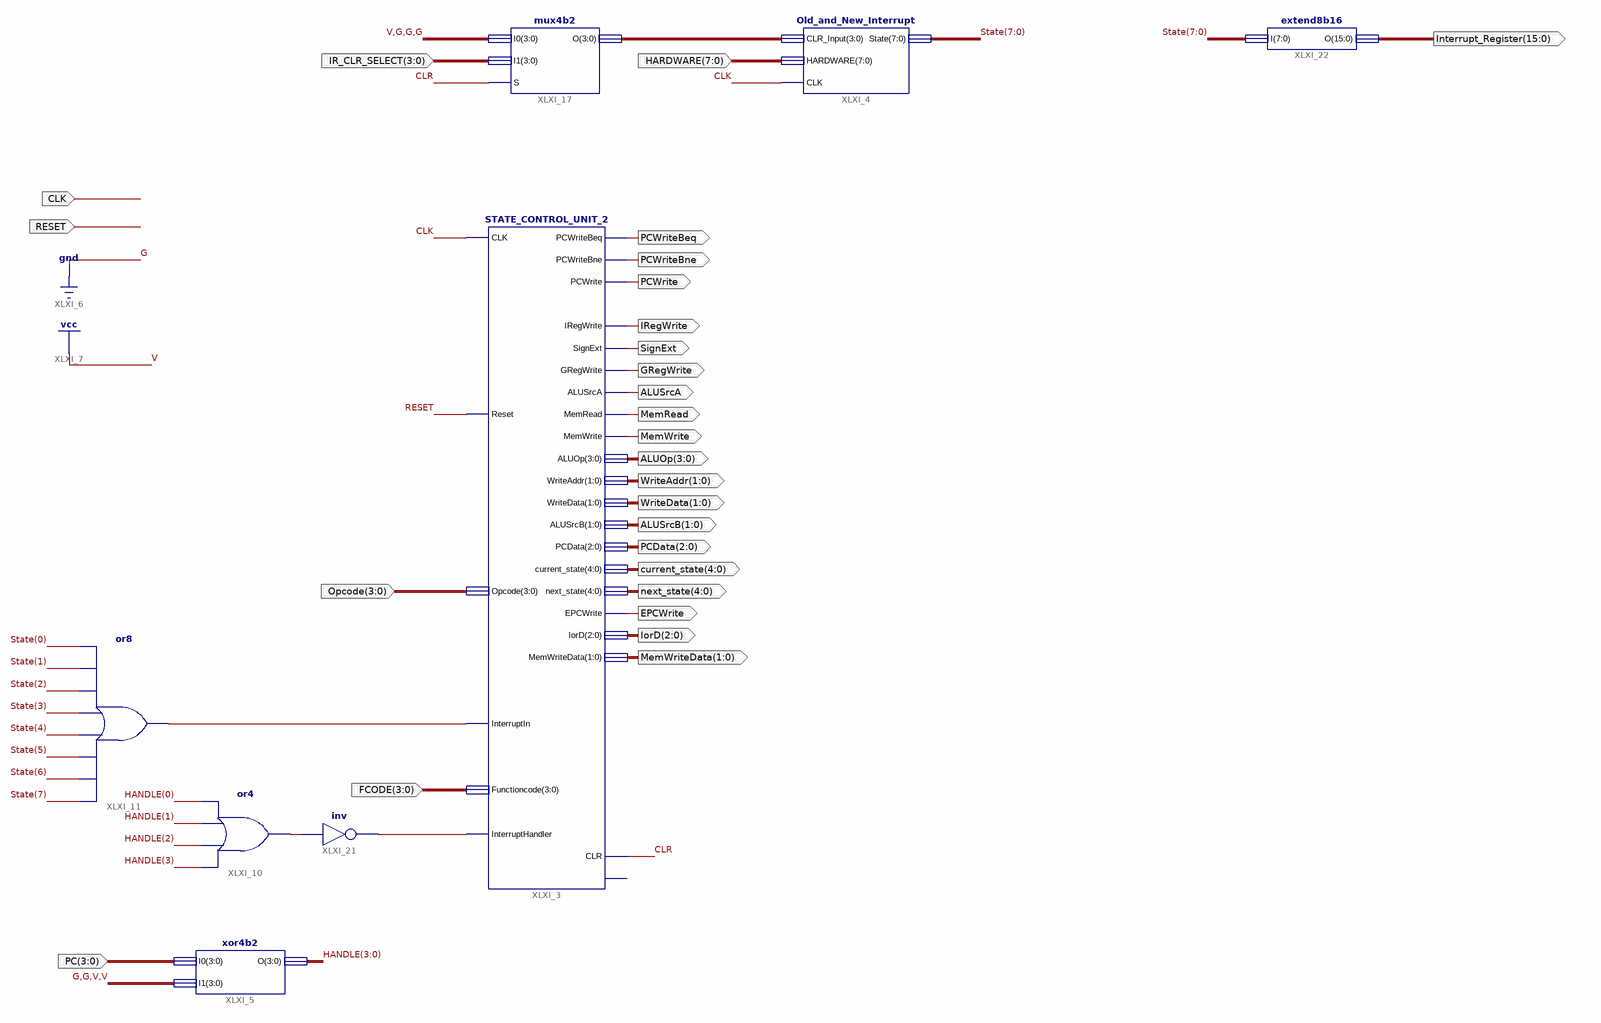
[diagram p0: schematic sheet 1]
// Xilinx ISE schematic interrupt_control.sch (spartan3e) as structural Verilog: 8 symbols, 27 ports
module interrupt_control (
  input  CLK,
  input  [7:0] HARDWARE,
  input  [3:0] IR_CLR_SELECT,
  input  RESET,
  input  [3:0] Opcode,
  input  [3:0] FCODE,
  input  [3:0] PC,
  output [15:0] Interrupt_Register,
  output PCWriteBeq,
  output PCWriteBne,
  output PCWrite,
  output IRegWrite,
  output SignExt,
  output GRegWrite,
  output ALUSrcA,
  output MemRead,
  output MemWrite,
  output [3:0] ALUOp,
  output [1:0] WriteAddr,
  output [1:0] WriteData,
  output [1:0] ALUSrcB,
  output [2:0] PCData,
  output [4:0] current_state,
  output EPCWrite,
  output [2:0] IorD,
  output [1:0] MemWriteData,
  output [4:0] next_state
);

  wire CLR, XLXN_29, XLXN_119, XLXN_120;
  wire [3:0] HANDLE, XLXN_94;
  wire [7:0] State;

  Old_and_New_Interrupt XLXI_4 (.CLR_Input(XLXN_94), .HARDWARE(HARDWARE), .CLK(CLK), .State(State));
  mux4b2 XLXI_17 (.I0(4'b1000), .I1(IR_CLR_SELECT), .S(CLR), .O(XLXN_94));
  STATE_CONTROL_UNIT_2 XLXI_3 (
    .CLK(CLK), .InterruptIn(XLXN_29), .InterruptHandler(XLXN_120), .Reset(RESET), .Opcode(Opcode),
    .Functioncode(FCODE), .PCWriteBeq(PCWriteBeq), .PCWriteBne(PCWriteBne), .PCWrite(PCWrite),
    .IRegWrite(IRegWrite), .SignExt(SignExt), .GRegWrite(GRegWrite), .ALUSrcA(ALUSrcA), .MemRead(MemRead),
    .MemWrite(MemWrite), .EPCWrite(EPCWrite), .CLR(CLR), .ALUOp(ALUOp), .IorD(IorD), .WriteAddr(WriteAddr),
    .WriteData(WriteData), .ALUSrcB(ALUSrcB), .PCData(PCData), .current_state(current_state),
    .next_state(next_state), .MemWriteData(MemWriteData));  // open: LCDWrite
  xor4b2 XLXI_5 (.I0(PC), .I1(4'b0011), .O(HANDLE));
  or XLXI_11 (XLXN_29, State[7], State[6], State[5], State[4], State[3], State[2], State[1], State[0]);
  or XLXI_10 (XLXN_119, HANDLE[3], HANDLE[2], HANDLE[1], HANDLE[0]);
  not XLXI_21 (XLXN_120, XLXN_119);
  extend8b16 XLXI_22 (.I(State), .O(Interrupt_Register));
endmodule
